# Altium project Underwater_Robot_Controller -V2.PrjPcb (part 2 of 2)
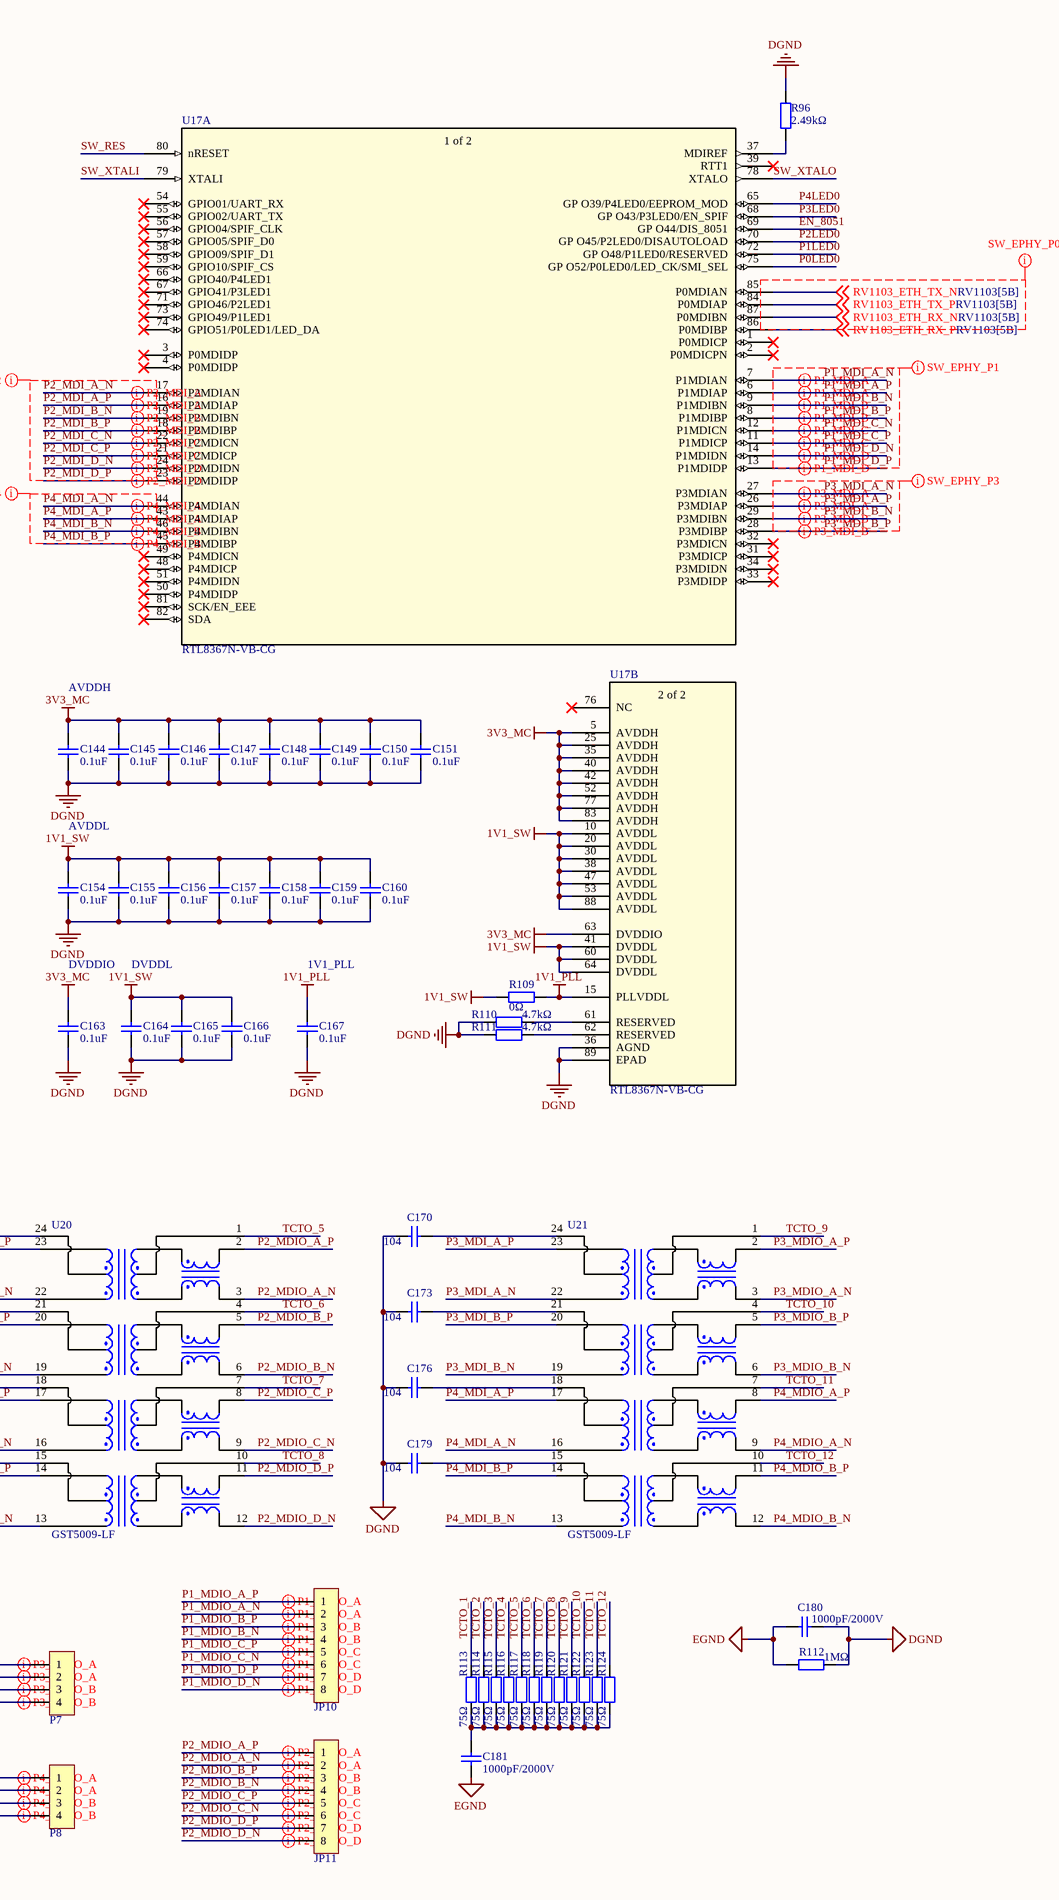
[diagram p7: Communication_Management.SchDoc, right]

## Nets that join several sheets
1V1_SW: Power (8 pins), Communication_Management (21 pins)
3V3_MC: ESP32 (39 pins), Power (8 pins), Communication_Management (20 pins)
+5V: ESP32 (C45.1 C47.1 U6.7 U6.8), Power (39 pins), Communication_Management (C140.2 C141.2 U18.19)
CORE_0V9: RV1103 (21 pins), Power (8 pins)
DDR_1V8: RV1103 (13 pins), Power (10 pins)
DGND: RV1103 (88 pins), ESP32 (86 pins), Power (7 pins), Communication_Management (65 pins)
GPIO_1V8: RV1103 (12 pins), Power (C75.2 C76.2 FB3.2)
GPIO_3V3: RV1103 (44 pins), Power (8 pins)
PGND: Power (104 pins), Communication_Management (6 pins)
VBUS: Power (C212.1 R127.1 R128.2 U23.5), Communication_Management (J3.A4 J3.A9 J3.B4 J3.B9)
CP2102_USB_N: ESP32 (U6.5), Communication_Management (U18.11)
CP2102_USB_P: ESP32 (U6.4), Communication_Management (U18.12)
ESP32_UART2_RX: RV1103 (U1.13), ESP32 (U7.6)
ESP32_UART2_TX: RV1103 (U1.14), ESP32 (U7.8)
ESP32_USB_D_N: ESP32 (U7.25), Communication_Management (U18.7)
ESP32_USB_D_P: ESP32 (U7.26), Communication_Management (U18.8)
RV1103_D_N: RV1103 (U1.18), Communication_Management (U18.9)
RV1103_D_P: RV1103 (U1.19), Communication_Management (U18.10)
RV1103_ETH_RX_N: RV1103 (U1.67), Communication_Management (U17.87)
RV1103_ETH_RX_P: RV1103 (U1.68), Communication_Management (U17.86)
RV1103_ETH_TX_N: RV1103 (U1.69), Communication_Management (U17.85)
RV1103_ETH_TX_P: RV1103 (U1.70), Communication_Management (U17.84)

## Assembly variants
NC: not fitted R13 R41 R79 R127 R? R? R? R? R? R? R? R?